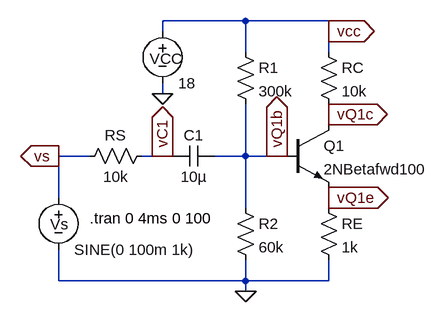
[diagram p0: schematic blitz01.asc]
blitz01.asc, the LTspice schematic file:
Version 4
SHEET 1 880 680
WIRE 160 -32 32 -32
WIRE 288 -32 160 -32
WIRE 32 -16 32 -32
WIRE 288 -16 288 -32
WIRE 160 16 160 -32
WIRE 288 16 288 -16
WIRE 32 80 32 64
WIRE 288 112 288 96
WIRE 288 128 288 112
WIRE -80 176 -128 176
WIRE 32 176 0 176
WIRE 48 176 32 176
WIRE 160 176 160 96
WIRE 160 176 112 176
WIRE 208 176 160 176
WIRE 224 176 208 176
WIRE -128 240 -128 176
WIRE 288 240 288 224
WIRE 160 256 160 176
WIRE 288 256 288 240
WIRE -128 368 -128 320
WIRE 160 368 160 336
WIRE 160 368 -128 368
WIRE 288 368 288 336
WIRE 288 368 160 368
WIRE 160 384 160 368
FLAG 32 80 0
FLAG 160 384 0
FLAG 288 -16 vcc
IOPIN 288 -16 Out
FLAG 288 112 vQ1c
IOPIN 288 112 Out
FLAG 288 240 vQ1e
IOPIN 288 240 Out
FLAG 208 176 vQ1b
IOPIN 208 176 Out
FLAG -128 176 vs
IOPIN -128 176 Out
FLAG 32 176 vC1
IOPIN 32 176 Out
SYMBOL npn 224 128 R0
SYMATTR InstName Q1
SYMATTR Value 2NBetafwd100
SYMBOL res 144 0 R0
SYMATTR InstName R1
SYMATTR Value 300k
SYMBOL res 144 240 R0
SYMATTR InstName R2
SYMATTR Value 60k
SYMBOL res 272 0 R0
SYMATTR InstName RC
SYMATTR Value 10k
SYMBOL res 272 240 R0
SYMATTR InstName RE
SYMATTR Value 1k
SYMBOL res 16 160 R90
WINDOW 0 0 56 VBottom 2
WINDOW 3 32 56 VTop 2
SYMATTR InstName RS
SYMATTR Value 10k
SYMBOL cap 112 160 R90
WINDOW 0 0 32 VBottom 2
WINDOW 3 32 32 VTop 2
SYMATTR InstName C1
SYMATTR Value 10µ
SYMBOL voltage -128 224 R0
WINDOW 0 -13 57 Left 2
WINDOW 123 0 0 Left 0
WINDOW 39 0 0 Left 0
SYMATTR InstName Vs
SYMATTR Value SINE(0 100m 1k)
SYMBOL voltage 32 -32 R0
WINDOW 0 -20 58 Left 2
SYMATTR InstName VCC
SYMATTR Value 18
TEXT -80 272 Left 2 !.tran 0 4ms 0 100

The netlist it stands for:
* blitz01.asc
Q1 vQ1c vQ1b vQ1e 0 2NBetafwd100
R1 vcc vQ1b 300k
R2 vQ1b 0 60k
RC vcc vQ1c 10k
RE vQ1e 0 1k
RS vC1 vs 10k
C1 vQ1b vC1 10µ
Vs vs 0 SINE(0 100m 1k)
VCC vcc 0 18
.model NPN NPN
.model PNP PNP
.lib standard.bjt
.tran 0 4ms 0 100
.backanno
.end